# Altium schematic sheet Superseal 26pos.SchDoc
size A
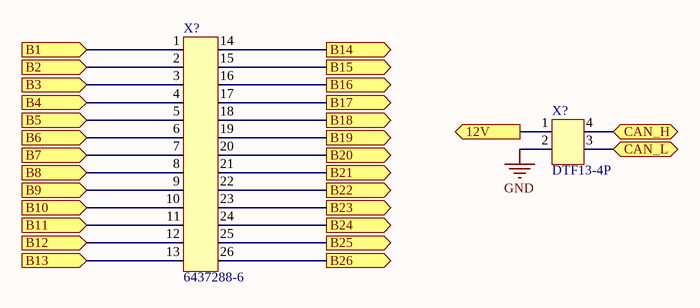
[diagram p0: Superseal 26pos.SchDoc]

## Parts
(Parts that share a designator on the sheet are numbered #1, #2 ... from top to bottom, then left to right.)
X?#1  6437288-6  [TE_Amp_6437288-6]
X?#2  DTF13-4P  [DTF13-4P]

## Ports
12V (out), B1 (in), B2 (in), B3 (in), B4 (in), B5 (in), B6 (in), B7 (in), B8 (in), B9 (in), B10 (in), B11 (in), B12 (in), B13 (in), B14 (out), B15 (out), B16 (out), B17 (out), B18 (out), B19 (out), B20 (out), B21 (out), B22 (out), B23 (out), B24 (out), B25 (out), B26 (out), CAN_H (bidir), CAN_L (bidir)

## Nets
GND: X?#2.2
12V: X?#2.1 ; port 12V
B1: X?#1.1 ; port B1
B2: X?#1.2 ; port B2
B3: X?#1.3 ; port B3
B4: X?#1.4 ; port B4
B5: X?#1.5 ; port B5
B6: X?#1.6 ; port B6
B7: X?#1.7 ; port B7
B8: X?#1.8 ; port B8
B9: X?#1.9 ; port B9
B10: X?#1.10 ; port B10
B11: X?#1.11 ; port B11
B12: X?#1.12 ; port B12
B13: X?#1.13 ; port B13
B14: X?#1.14 ; port B14
B15: X?#1.15 ; port B15
B16: X?#1.16 ; port B16
B17: X?#1.17 ; port B17
B18: X?#1.18 ; port B18
B19: X?#1.19 ; port B19
B20: X?#1.20 ; port B20
B21: X?#1.21 ; port B21
B22: X?#1.22 ; port B22
B23: X?#1.23 ; port B23
B24: X?#1.24 ; port B24
B25: X?#1.25 ; port B25
B26: X?#1.26 ; port B26
CAN_H: X?#2.4 ; port CAN_H
CAN_L: X?#2.3 ; port CAN_L

## Library data of the parts
X?#1 = 7: Straight Angle 26Pos AMPSeal; Manufacturer_id: 5; idConn: 7; Drawer_id: 1; Name: AMP SuperSeal Straight; Value: CONN; Voltage_Rating: 250V; Num_Contacts: 26; Num_Rows: 4; Pitch: 3mm; Created_By: Nick; MfrPartNo: 6437288-6; Link: https://www.digikey.com/product-detail/en/te-connectivity-amp-connectors/6437288-6/A123256-ND/2329274; ComponentLink1Description: Drawing; ComponentLink1URL: https://www.te.com/commerce/DocumentDelivery/DDEController?Action=srchrtrv&DocNm=1437288-6&DocType=Customer+Drawing&DocLang=JP; Supplier1: Digi-Key; Supplier1PartNo: A123256-ND
X?#2 = 15: 2 row 4 pin Board; Manufacturer_id: 1; idConn: 15; Value: CONN; Num_Contacts: 4; Created_By: Angel; MfrPartNo: DTF13-4P; Drawer_id: 1; Name: DTF13-4P; Link: https://www.te.com/usa-en/product-DTF13-4P.html; ComponentLink1Description: Datasheet; Supplier1: TE